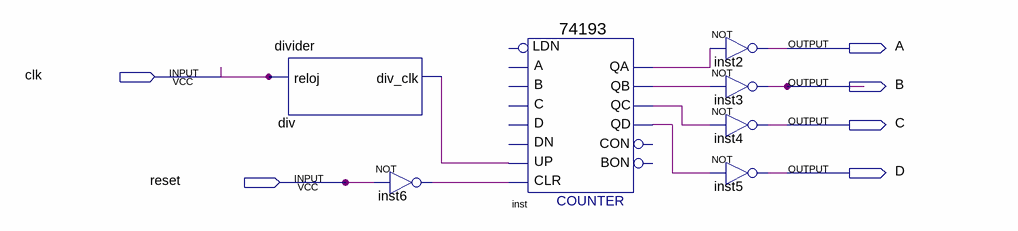
[diagram p0: schematic sheet]
// Quartus schematic practica1.bdf as structural Verilog: 7 symbols, 6 pins
module practica1 (
  input  clk,
  input  reset,
  output A,
  output B,
  output C,
  output D
);

  wire div_div_clk, inst6_out, inst_qa, inst_qb, inst_qc, inst_qd;

  divider div (.reloj(clk), .div_clk(div_div_clk));
  not inst6 (inst6_out, reset);
  \74193  inst (
    .CLR(inst6_out), .UP(div_div_clk), .QB(inst_qb), .QA(inst_qa), .QD(inst_qd), .QC(inst_qc));  // open: D, C, B, A, DN, LDN, CON, BON
  not inst2 (A, inst_qa);
  not inst3 (B, inst_qb);
  not inst4 (C, inst_qc);
  not inst5 (D, inst_qd);
endmodule
